# EAGLE design TestA (EAGLE 9.6.2)
IGNORE_RENUMBER: TP
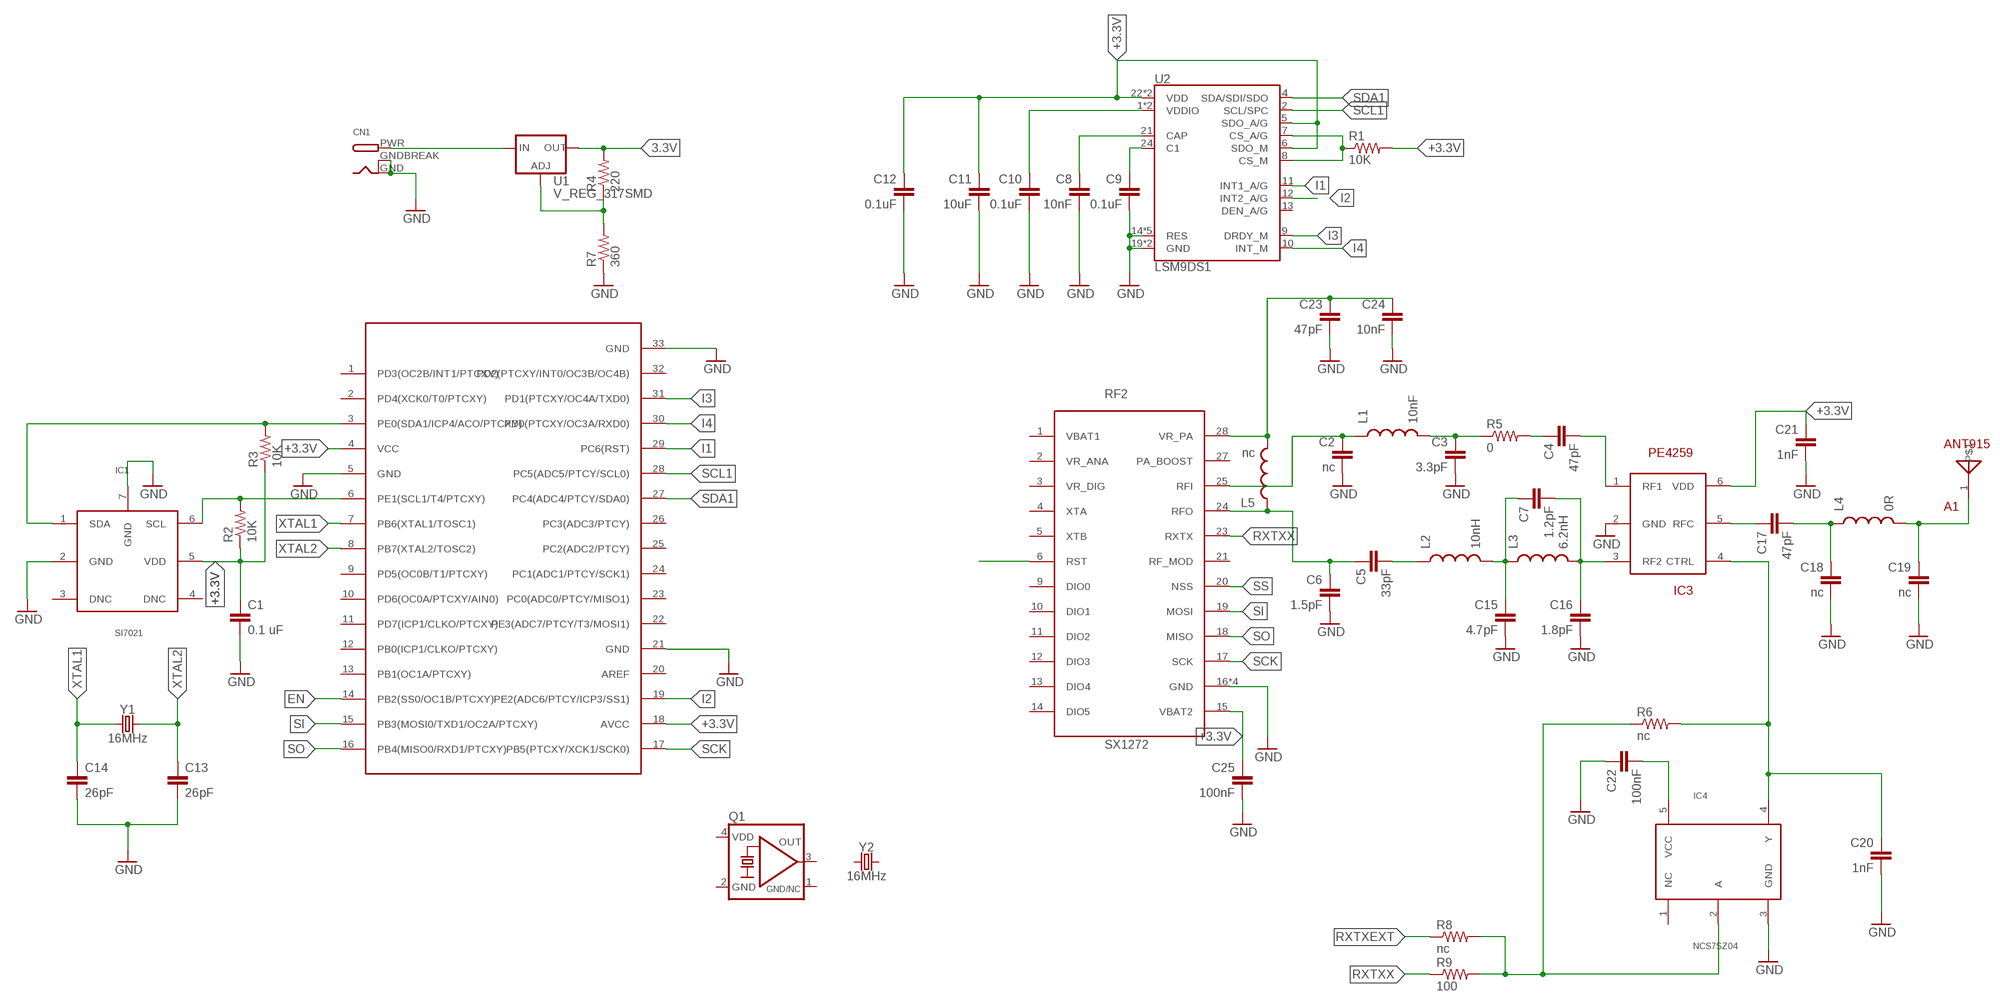
[diagram p0: schematic, sheet 1]

## Parts
A1  ANT915  [ANT915]
C1  0.1 uF  CAP0603-CAP  [0603-CAP]
C2  nc  CAP0603-CAP  [0603-CAP]
C3  3.3pF  CAP0603-CAP  [0603-CAP]
C4  47pF  CAP0603-CAP  [0603-CAP]
C5  33pF  CAP0603-CAP  [0603-CAP]
C6  1.5pF  CAP0603-CAP  [0603-CAP]
C7  1.2pF  CAP0603-CAP  [0603-CAP]
C8  10nF  CAP0603-CAP  [0603-CAP]
C9  0.1uF  CAP0603-CAP  [0603-CAP]
C10  0.1uF  CAP0603-CAP  [0603-CAP]
C11  10uF  CAP0603-CAP  [0603-CAP]
C12  0.1uF  CAP0603-CAP  [0603-CAP]
C13  26pF  CAP0603-CAP  [0603-CAP]
C14  26pF  CAP0603-CAP  [0603-CAP]
C15  4.7pF  CAP0603-CAP  [0603-CAP]
C16  1.8pF  CAP0603-CAP  [0603-CAP]
C17  47pF  CAP0603-CAP  [0603-CAP]
C18  nc  CAP0603-CAP  [0603-CAP]
C19  nc  CAP0603-CAP  [0603-CAP]
C20  1nF  CAP0603-CAP  [0603-CAP]
C21  1nF  CAP0603-CAP  [0603-CAP]
C22  100nF  CAP0603-CAP  [0603-CAP]
C23  47pF  CAP0603-CAP  [0603-CAP]
C24  10nF  CAP0603-CAP  [0603-CAP]
C25  100nF  CAP0603-CAP  [0603-CAP]
CN1  DCBARRELPTH  [DCJACK_2MM_PTH]
IC1  SI7021  [SI7021]
IC2  ATMEGA328-PB  [ATMEGA328-PB]
IC3  PE4259  [PE4259]
IC4  NCS7SZ04  [NC7SZ04]
L1  10nF  INDUCTOR0603  [0603]
L2  10nH  INDUCTOR0603  [0603]
L3  6.2nH  INDUCTOR0603  [0603]
L4  0R  INDUCTOR0603  [0603]
L5  nc  INDUCTOR0603  [0603]
Q1  KXO-TCXO-CMOS-86  [2.5X2.0_KXO-86-TCXO]
R1  10K  RESISTOR0603-RES  [0603-RES]
R2  10K  RESISTOR0603-RES  [0603-RES]
R3  10K  RESISTOR0603-RES  [0603-RES]
R4  220  RESISTOR0603-RES  [0603-RES]
R5  0  RESISTOR0603-RES  [0603-RES]
R6  nc  RESISTOR0603-RES  [0603-RES]
R7  360  RESISTOR0603-RES  [0603-RES]
R8  nc  RESISTOR0603-RES  [0603-RES]
R9  100  RESISTOR0603-RES  [0603-RES]
RF2  SX1272  [SX1272]
U1  V_REG_317SMD  [SOT223]
U2  LSM9DS1  [LGA24-8X4]
Y1  16MHz  CRYSTAL-16MHZSMD-2X1.6  [CRYSTAL-SMD-2.0X1.6MM]
Y2  16MHz  CRYSTAL-16MHZSMD-2X1.6  [CRYSTAL-SMD-2.0X1.6MM]

## Nets
3.3V: R4.2 U1.2(OUT)
+3.3V: C1.1 C11.1 C12.1 C21.1 C25.1 IC1.5(VDD) IC2.4(VCC) IC2.18(AVCC) IC3.6(VDD) R1.2 R2.1 R3.1 RF2.15(VBAT2) U2.5(SDO_A/G) U2.6(SDO_M) U2.22(VDD) U2.23(VDD)
EN: IC2.14(PB2(SS0/OC1B/PTCXY))
GND: C1.2 C2.2 C3.2 C6.2 C8.2 C9.2 C10.2 C11.2 C12.2 C13.2 C14.2 C15.2 C16.2 C18.2 C19.2 C20.2 C21.2 C22.1 C23.2 C24.2 C25.2 CN1.GND CN1.GNDBREAK IC1.2(GND) IC1.7(GND) IC2.5(GND) IC2.21(GND) IC2.33(GND) IC3.2(GND) IC4.3(GND) R7.1 RF2.16(GND) RF2.22(GND) RF2.26(GND) RF2.29(GND) U2.14(RES) U2.15(RES) U2.16(RES) U2.17(RES) U2.18(RES) U2.19(GND) U2.20(GND)
I1: IC2.29(PC6(RST)) U2.11(INT1_A/G)
I2: IC2.19(PE2(ADC6/PTCY/ICP3/SS1)) U2.12(INT2_A/G)
I3: IC2.31(PD1(PTCXY/OC4A/TXD0)) U2.9(DRDY_M)
I4: IC2.30(PD0(PTCXY/OC3A/RXD0)) U2.10(INT_M)
N$1: C4.1 R5.2
N$2: C23.1 C24.1 L5.2 RF2.28(VR_PA)
N$3: CN1.PWR U1.3(IN)
N$4: C4.2 IC3.1(RF1)
N$5: R1.1 U2.7(CS_A/G) U2.8(CS_M)
N$6: R4.1 R7.2 U1.1(ADJ)
N$7: C2.1 L1.1 RF2.25(RFI)
N$8: C8.1 U2.21(CAP)
N$9: C10.1 U2.1(VDDIO) U2.3(VDDIO)
N$10: C3.1 L1.2 R5.1
N$11: C5.1 C6.1 L5.1 RF2.24(RFO)
N$12: C7.1 C15.1 L2.2 L3.1
N$13: C5.2 L2.1
N$14: C7.2 C16.1 IC3.3(RF2) L3.2
N$15: A1.1 C19.1 L4.2
N$16: C17.1 IC3.5(RFC)
N$17: C9.1 U2.24(C1)
N$18: C17.2 C18.1 L4.1
N$19: C20.1 IC3.4(CTRL) IC4.4(Y) R6.2
N$20: C22.2 IC4.5(VCC)
N$21: IC4.2(A) R6.1 R8.2 R9.2
N$22: RF2.6(RST)
RXTXEXT: R8.1
RXTXX: R9.1 RF2.23(RXTX)
SCK: IC2.17(PB5(PTCXY/XCK1/SCK0)) RF2.17(SCK)
SCL: IC1.6(SCL) IC2.6(PE1(SCL1/T4/PTCXY)) R2.2
SCL1: IC2.28(PC5(ADC5/PTCY/SCL0)) U2.2(SCL/SPC)
SDA: IC1.1(SDA) IC2.3(PE0(SDA1/ICP4/ACO/PTCXY)) R3.2
SDA1: IC2.27(PC4(ADC4/PTCY/SDA0)) U2.4(SDA/SDI/SDO)
SI: IC2.15(PB3(MOSI0/TXD1/OC2A/PTCXY)) RF2.19(MOSI)
SO: IC2.16(PB4(MISO0/RXD1/PTCXY)) RF2.18(MISO)
SS: RF2.20(NSS)
XTAL1: C14.1 IC2.7(PB6(XTAL1/TOSC1)) Y1.1
XTAL2: C13.1 IC2.8(PB7(XTAL2/TOSC2)) Y1.3
Unconnected: IC1.3(DNC) IC1.4(DNC) IC2.1(PD3(OC2B/INT1/PTCXY)) IC2.2(PD4(XCK0/T0/PTCXY)) IC2.9(PD5(OC0B/T1/PTCXY)) IC2.10(PD6(OC0A/PTCXY/AIN0)) IC2.11(PD7(ICP1/CLKO/PTCXY)) IC2.12(PB0(ICP1/CLKO/PTCXY)) IC2.13(PB1(OC1A/PTCXY)) IC2.20(AREF) IC2.22(PE3(ADC7/PTCY/T3/MOSI1)) IC2.23(PC0(ADC0/PTCY/MISO1)) IC2.24(PC1(ADC1/PTCY/SCK1)) IC2.25(PC2(ADC2/PTCY)) IC2.26(PC3(ADC3/PTCY)) IC2.32(PD2(PTCXY/INT0/OC3B/OC4B)) IC4.1(NC) Q1.3(OUT) RF2.1(VBAT1) RF2.2(VR_ANA) RF2.3(VR_DIG) RF2.4(XTA) RF2.5(XTB) RF2.9(DIO0) RF2.10(DIO1) RF2.11(DIO2) RF2.12(DIO3) RF2.13(DIO4) RF2.14(DIO5) RF2.21(RF_MOD) RF2.27(PA_BOOST) U2.13(DEN_A/G) Y2.1 Y2.3

## Power pins joined to a net without a drawn wire
GND: Q1.2(GND)
GND/NC: Q1.1(GND/NC)
VDD: Q1.4(VDD)

## Library data of the parts
A1 = Mini-Project:ANT915
C1-C25 = SparkFun:CAP: Capacitor Standard 0603 ceramic capacitor, and 0.1" leaded capacitor.
CN1 = adafruit:DCBARREL: 2.0mm DC Barrel Jack DCJACK_2MM_PTH - Through Hole Jack (4UConnector: 05537)
IC1 = Mini-Project:SI7021
IC2 = Mini-Project:ATMEGA328-PB
IC3 = Mini-Project:PE4259
IC4 = Mini-Project:NCS7SZ04
L1-L5 = SparkFun:INDUCTOR: Inductors Basic Inductor/Choke - 0603 and 1206. Footprints are not proven and vary greatly between part numbers.
Q1 = crystal-geyer_V1_0:KXO-TCXO-CMOS: TCXO : CMOS - Serie Model Size l/w/h [mm] Frequency Range Frequency Stability Temp. Range [°C] Output AECQ 200 availabel Datasheet KXO-86 KXO-84 KXO-83 KXO-82 2.5/2.0/0.7 3.2/2.5/1.0 5.0/3.2/1.5 7.0/5.0/2.4 13,0 ~ 40,0 MHz 10,0 ~ 40,0 MHz 10,0 ~ 40,0 MHz 10,0 ~ 30,0 MHz ±1,0 … ±2,5ppm ±1,0 … ±2,5ppm ±1,0 … ±3,0ppm ±1,0 … ±3,0ppm (*) -30°C …+75°C (*) -40°C …+85°C (*) -40°C …+85°C (*) -30°C …+80°C CMOS CMOS CMOS CMOS - - - - KXO-86.pdf <http://www.geyer-electronic.de/uploads/tx_userartikelfrequenz/GEYER-KXO-86-TCXO-HCMOS.pdf> KXO-84.pdf <http://www.geyer-electronic.de/uploads/tx_userartikelfrequenz/GEYER-KXO-84-TCXO-HCMOS.pdf> KXO-83.pdf <http://www.geyer-electronic.de/uploads/tx_userartikelfrequenz/GEYER-KXO-83-TCXO-HCMOS.pdf> KXO-82.pdf <http://www.geyer-electronic.de/uploads/tx_userartikelfrequenz/GEYER-KXO-82-TCXO-HCMOS.pdf> <http://www.geyer-electronic.de/fileadmin/template/img/logo-geyer-electronic.png> Details see: http://www.geyer-electronic.de/Frequenz-Produkte.9.0.html Created 2016-06-07, Hans Locher 2016 (C) Geyer Quartz Technology KXO86,KXO84,KXO83,KXO82;2550;3225;5032;7050;2,5x2,0;3,2x2,5;2.5x2.0;3.2x2.5,5,0x3,2;7,0x5,0,5.0x3.2,7.0x5.0
R1-R9 = SparkFun:RESISTOR: Resistor Basic schematic elements and footprints for 0603, 1206, and PTH resistors.
RF2 = Mini-Project:SX1272
U1 = SparkFun:V_REG_317: Voltage Regulator Standard LM317 adjustable voltage regulator. AOI (Adjust Output Input). Google 'LM317 Calculator' for easy to use app to get the two resistor values needed. 240/720 for 5V output. 240/390 for 3.3V output. Spark Fun Electronics SKU : COM-00527
U2 = LSM9DS1:LSM9DS1: LSM9DS1 3D accelerometer, gyroscope & magnetometer The LSM9DS1 is a system-in-package featuring a 3D digital linear acceleration sensor, a 3D digital angular rate sensor, and a 3D digital magnetic sensor. The LSM9DS1 has a linear acceleration full scale of ±2g/±4g/±8/±16 g, a magnetic field full scale of ±4/±8/±12/±16 gauss and an angular rate of ±245/±500/±2000 dps. The LSM9DS1 includes an I2 C serial bus interface supporting standard and fast mode (100 kHz and 400 kHz) and an SPI serial standard interface. Magnetic, accelerometer and gyroscope sensing can be enabled or set in power-down mode separately for smart power management. The LSM9DS1 is available in a plastic land grid array package (LGA) and it is guaranteed to operate over an extended temperature range from -40 °C to +85 °C.; PROD_ID: IC-12536
Y1 Y2 = SparkFun-Clocks:CRYSTAL-16MHZ: 16MHz Crystal Digikey Example <http://www.digikey.com/product-search/en?keywords=535-9122-1-ND> Frequency: 16MHz Frequency Stability: ±50ppm Frequency Tolerance: ±20ppm Load Capacitance: 18pF SparkFun Products: Pro Micro -5V/16MHz <https://www.sparkfun.com/products/12640> SparkFun Serial Enabled LCD Kit <https://www.sparkfun.com/products/10097>; PROD_ID: XTAL-14681

## Board
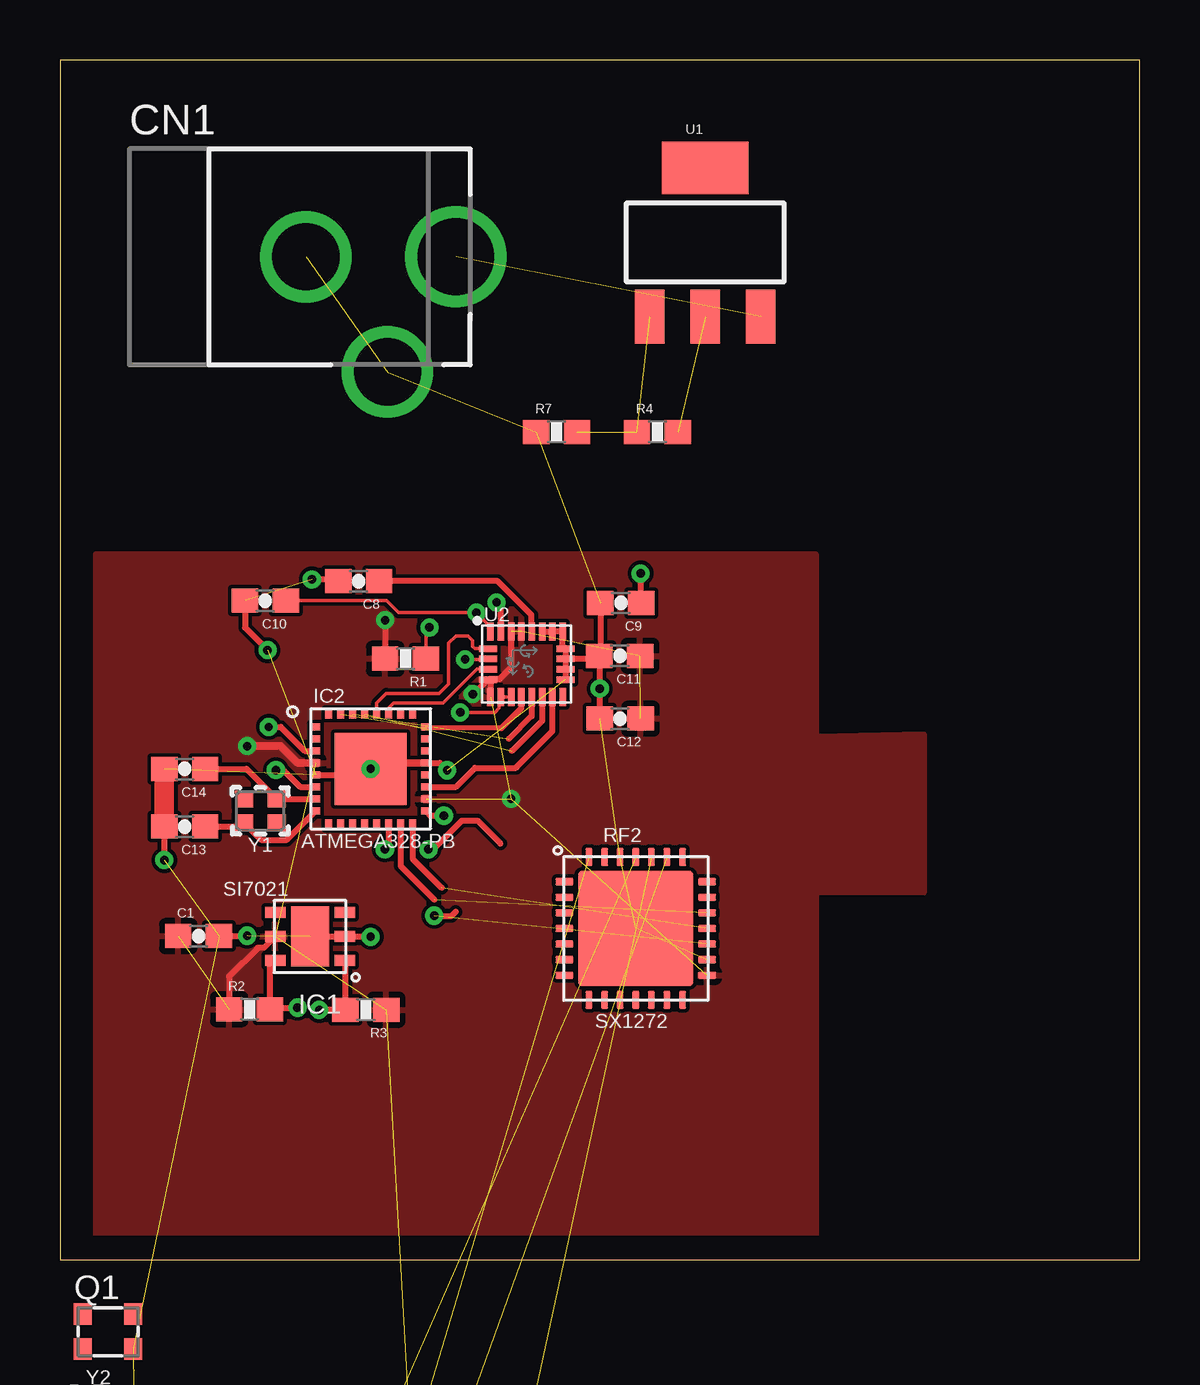
[diagram p1: board, top side]
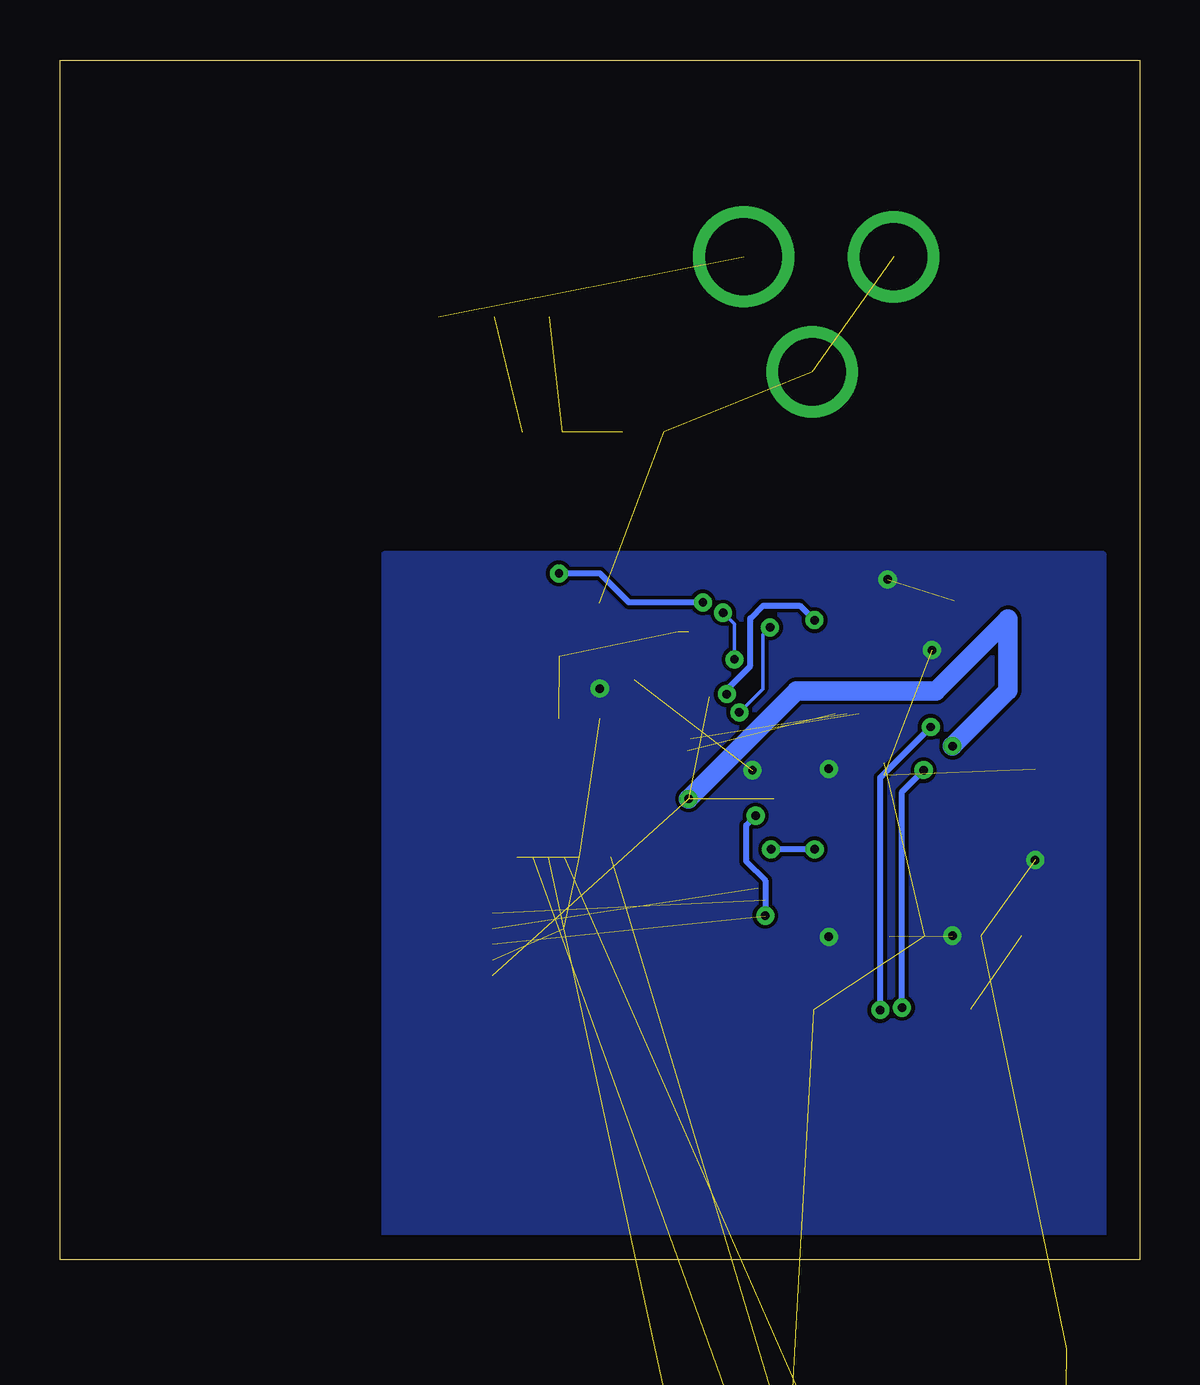
[diagram p2: board, bottom side, seen from below]

Size 45 x 50 mm. Coordinates in mm from the lower left corner, seen from the top.
Outline: 0,0 45,0 45,50 0,50 0,0
Copper layers (1*16): Top 0.035mm / dielectric 1.5mm / Bottom 0.035mm
Design rules "default": minimum track width 6mil, minimum drill 0.35mm, track to track 6mil, track to pad 6mil, pad to pad 6mil, via to via 6mil, smd to smd 6mil, copper to edge 40mil, drill to drill 6mil, minimum pad ring 10mil, minimum via ring 8mil, stop-mask expansion 4mil, vias tented up to drill 0mil, thermal gap 10mil

### Footprints (pad centres in the part's own frame; a part is rotated, then mirrored left to right if it is on the bottom)
ANT915 = smd 2 x 2.5: 1 -5.1,0; 2 5.1,0
0603-CAP = smd 1.1 x 1: 1 -0.85,0; 2 0.85,0
DCJACK_2MM_PTH = drill 2.8: GND 0,7.35; GNDBREAK 4.8,10.75 | drill 3.2: PWR 0,13.6
SI7021 = smd 0.85 x 0.45: 1 -1.45,1; 2 -1.45,0; 3 -1.45,-1; 4 1.45,-1; 5 1.45,0; 6 1.45,1 | smd 1.6 x 2.5: 7 0,0
ATMEGA328-PB = smd 0.4 x 0.3: 1 -2.3,1.75; 2 -2.3,1.25; 3 -2.3,0.75; 4 -2.3,0.25; 5 -2.3,-0.25; 6 -2.3,-0.75; 7 -2.3,-1.25; 8 -2.3,-1.75; 17 2.3,-1.75; 18 2.3,-1.25; 19 2.3,-0.75; 20 2.3,-0.25; 21 2.3,0.25; 22 2.3,0.75; 23 2.3,1.25; 24 2.3,1.75 | smd 0.3 x 0.4: 9 -1.75,-2.3; 10 -1.25,-2.3; 11 -0.75,-2.3; 12 -0.25,-2.3; 13 0.25,-2.3; 14 0.75,-2.3; 15 1.25,-2.3; 16 1.75,-2.3; 25 1.75,2.3; 26 1.25,2.3; 27 0.75,2.3; 28 0.25,2.3; 29 -0.25,2.3; 30 -0.75,2.3; 31 -1.25,2.3; 32 -1.75,2.3 | smd 3 x 3: 33 0,0
PE4259 = smd 0.4 x 0.9: 1 -0.65,-1.05; 2 0,-1.05; 3 0.65,-1.05; 4 0.65,1.05; 5 0,1.05; 6 -0.65,1.05
NC7SZ04 = smd 0.7 x 1: 1 -0.95,-1.2; 2 0,-1.2; 3 0.95,-1.2; 4 0.95,1.2; 5 -0.95,1.2
0603 = smd 1.1 x 1: 1 -0.85,0; 2 0.85,0
2.5X2.0_KXO-86-TCXO = smd 0.75 x 0.9: 1 -1.05,-0.725; 2 1.05,-0.725; 3 1.05,0.725; 4 -1.05,0.725
0603-RES = smd 1.1 x 1: 1 -0.85,0; 2 0.85,0
SX1272 = smd 0.75 x 0.3: 1 -2.975,1.95; 2 -2.975,1.3; 3 -2.975,0.65; 4 -2.975,0; 5 -2.975,-0.65; 6 -2.975,-1.3; 7 -2.975,-1.95; 15 2.975,-1.95; 16 2.975,-1.3; 17 2.975,-0.65; 18 2.975,0; 19 2.975,0.65; 20 2.975,1.3; 21 2.975,1.95 | smd 0.3 x 0.75: 8 -1.95,-2.975; 9 -1.3,-2.975; 10 -0.65,-2.975; 11 0,-2.975; 12 0.65,-2.975; 13 1.3,-2.975; 14 1.95,-2.975; 22 1.95,2.975; 23 1.3,2.975; 24 0.65,2.975; 25 0,2.975; 26 -0.65,2.975; 27 -1.3,2.975; 28 -1.95,2.975 | smd 4.8 x 4.8: 29 0,0
SOT223 = smd 1.219 x 2.235: 1 -2.311,-3.099; 2 0,-3.099; 3 2.311,-3.099 | smd 3.6 x 2.2: 4 0,3.099
LGA24-8X4 = smd 0.27 x 0.75: 1 -1.505,1.365; 6 -1.505,-1.365; 7 -1.075,-1.365; 8 -0.645,-1.365; 9 -0.215,-1.365; 10 0.215,-1.365; 11 0.645,-1.365; 12 1.075,-1.365; 13 1.505,-1.365; 18 1.505,1.365; 19 1.075,1.365; 20 0.645,1.365; 21 0.215,1.365; 22 -0.215,1.365; 23 -0.645,1.365; 24 -1.075,1.365 | smd 0.75 x 0.27: 2 -1.615,0.645; 3 -1.615,0.215; 4 -1.615,-0.215; 5 -1.615,-0.645; 14 1.615,-0.645; 15 1.615,-0.215; 16 1.615,0.215; 17 1.615,0.645
CRYSTAL-SMD-2.0X1.6MM = smd 0.75 x 0.7: 1 -0.675,-0.5; 2 0.675,-0.5; 3 0.675,0.5; 4 -0.675,0.5

### Placement (x,y rotation side)
A1  6.7,-30.5 0 top  (outside the outline)
C1  5.78,13.48 0 top
C2  1.6,-36.2 0 top  (outside the outline)
C3  4.7,-36.2 0 top  (outside the outline)
C4  7.8,-36.2 0 top  (outside the outline)
C5  10.9,-36.2 0 top  (outside the outline)
C6  14,-36.2 0 top  (outside the outline)
C7  17.1,-36.2 0 top  (outside the outline)
C8  12.45,28.28 180 top
C9  23.38,27.37 180 top
C10  8.56,27.46 180 top
C11  23.34,25.16 180 top
C12  23.35,22.55 180 top
C13  5.2,18.05 180 top
C14  5.2,20.45 180 top
C15  1.6,-39.2 0 top  (outside the outline)
C16  4.7,-39.2 0 top  (outside the outline)
C17  7.8,-39.2 0 top  (outside the outline)
C18  10.9,-39.2 0 top  (outside the outline)
C19  14,-39.2 0 top  (outside the outline)
C20  1.6,-15.5 0 top  (outside the outline)
C21  17.1,-39.2 0 top  (outside the outline)
C22  4.7,-15.5 0 top  (outside the outline)
C23  1.6,-54.2 0 top  (outside the outline)
C24  1.6,-57.2 0 top  (outside the outline)
C25  1.6,-63.2 0 top  (outside the outline)
CN1  2.9,41.8 270 top
IC1  10.43,13.46 180 top
IC2  12.95,20.45 0 top
IC3  15.9,-20.3 0 top  (outside the outline)
IC4  2.2,-11.1 0 top  (outside the outline)
L1  1.6,-42.2 0 top  (outside the outline)
L2  4.7,-42.2 0 top  (outside the outline)
L3  7.8,-42.2 0 top  (outside the outline)
L4  10.9,-42.2 0 top  (outside the outline)
L5  1.6,-60.2 0 top  (outside the outline)
Q1  2,-3 0 top
R1  14.4,25.05 180 top
R2  7.9,10.43 0 top
R3  12.75,10.41 180 top
R4  24.9,34.5 0 top
R5  14,-42.2 0 top  (outside the outline)
R6  1.6,-45.2 0 top  (outside the outline)
R7  20.7,34.5 0 top
R8  1.6,-48.2 0 top  (outside the outline)
R9  1.6,-51.2 0 top  (outside the outline)
RF2  24,13.8 0 top
U1  26.9,42.4 0 top
U2  19.45,24.82 0 top
Y1  8.35,18.7 180 top
Y2  1.6,-6.3 0 top  (outside the outline)

### Tracks (layer width: path | path; a pad name or v marks a point on that pad's centre or on a via)
3.3V  (1 unrouted)
+3.3V  (via drill 0.35)  (12 unrouted)
  Top 0.254: IC1.5 8.51,13 8.25,13 7.05,11.8 R2.1 | U2.5 17.84,24.15 17.88,24.19 18.33,24.19 18.8,24.67 U2.23 | U2.5 17.95,24.07 U2.6 | U2.5 17.23,23.57 v17.2,23.57 | v13.55,26.65 R1.2
  Top 0.305: v7.8,21.4 9.2,21.4 9.9,20.7 IC2.4
  Bottom 0.254: v17.2,23.57 17.2,23.77 16.23,24.74 16.23,26.72 15.69,27.26 14.16,27.26 v13.55,26.65
  Bottom 0.813: v7.8,21.4 5.48,23.72 5.48,26.7 8.48,23.7 14.3,23.7 v18.8,19.2
  pour Top: 1.5,29.4 31.5,29.4 31.5,21.8 36,21.9 36,21.8 36,15.3 31.5,15.3 31.5,0 1.5,0
EN  (via drill 0.35 pad 0.55)
  Top 0.254: IC2.14 13.7,17.26 v13.54,17.1 | v15.36,17.1 15.56,17.1 16.76,18.3 17.4,18.3 18.36,17.34
  Bottom 0.254: v13.54,17.1 v15.36,17.1
GND  (via drill 0.35, 0.35 pad 0.55)  (29 unrouted)
  Top 0.152: 22.48,23.82 v22.5,23.8
  Top 0.254: U2.14 U2.15 U2.16 | C12.2 v22.5,23.8 | C11.2 22.48,23.82 | U2.16 U2.17 20.95,25.57 U2.18 U2.19 U2.20 | C11.2 22.36,25.04 U2.16 | C9.2 22.52,25.2 C11.2 | C8.2 11.53,28.35 v10.5,28.35 | v8.65,25.4 7.71,26.34 C10.2 | IC2.21 15.83,20.7 v16.14,20.39 | v12.95,13.45 12.94,13.46 IC1.2 IC1.7 | C1.2 7.78,13.48 v7.8,13.5 | C13.2 v4.35,16.65 | IC2.5 12.7,20.2 IC2.33
  Top 0.305: IC2.21 13.2,20.7 IC2.33
  Top 0.813: C14.2 C13.2
  other vias: 12.95,20.45
  pour Bottom: 1.5,29.4 31.5,29.4 31.5,0 1.5,0
I1  (1 unrouted)
  Top 0.254: U2.11 20.09,22.45 18.84,21.2
I2
  Top 0.254: IC2.19 16.5,19.7 17.3,20.5 19,20.5 19.1,20.6 20.52,22.02 U2.12
I3  (1 unrouted)
  Top 0.203: 18.41,22.15 15.3,22.15
  Top 0.254: 18.41,22.15 19.23,22.98 U2.9
I4  (1 unrouted)
  Top 0.254: U2.10 19.66,22.65 18.71,21.7
N$1  (1 unrouted)
N$2  (3 unrouted)
N$3  (1 unrouted)
N$4  (1 unrouted)
N$5  (via drill 0.35 pad 0.55)
  Top 0.152: U2.8 U2.7 18.31,23.39 18.31,22.98 18.13,22.81 v16.68,22.81 | v15.4,26.35 15.25,26.2 R1.1
  Bottom 0.152: v16.68,22.81 15.7,23.79 15.7,26.05 v15.4,26.35
N$6  (2 unrouted)
N$7  (2 unrouted)
N$8
  Top 0.254: U2.21 19.65,26.2 19.65,26.87 18.24,28.28 C8.1
N$9  (via drill 0.35 pad 0.55)
  Top 0.152: C10.1 13.61,27.46 14.11,26.96 v17.36,26.96 17.95,26.38 U2.1 | U2.3 17.82,25.02 v16.89,25.02
  Bottom 0.152: v16.89,25.02 16.89,26.48 v17.36,26.96
N$10  (2 unrouted)
N$11  (3 unrouted)
N$12  (3 unrouted)
N$13  (1 unrouted)
N$14  (3 unrouted)
N$15  (2 unrouted)
N$16  (1 unrouted)
N$17  (via drill 0.35)
  Top 0.254: U2.24 18.38,27.22 v18.2,27.39 | v24.2,28.6 24.2,27.39 C9.1
  Bottom 0.254: v18.2,27.39 21.29,27.39 22.5,28.6 v24.2,28.6
N$18  (2 unrouted)
N$19  (3 unrouted)
N$20  (1 unrouted)
N$21  (3 unrouted)
RXTXX  (1 unrouted)
SCK  (via drill 0.35 pad 0.55)  (1 unrouted)
  Top 0.254: IC2.17 15.45,18.5 v16,18.5 | v15.6,14.33 16.33,14.33 16.49,14.49
  Bottom 0.254: v16,18.5 16.4,18.1 16.4,16.6 15.6,15.8 v15.6,14.33
SCL  (via drill 0.35)
  Top 0.254: IC1.6 8.75,12.24 R2.2 8.82,10.5 v9.9,10.5 | v9,20.4 9.3,20.4 10,19.7 IC2.6
  Bottom 0.254: v9.9,10.5 9.9,19.5 v9,20.4
SCL1
  Top 0.152: IC2.28 13.2,23.2 13.6,23.6 15.8,23.6 16.2,24 16.2,25.7 16.5,26 17,26 17.2,25.8 17.2,25.56 17.29,25.46 U2.2
SDA  (via drill 0.35)
  Top 0.2: 11.88,12.43 IC1.1
  Top 0.254: 11.88,12.43 11.9,12.4 R3.2 10.82,10.41 v10.81,10.4 | v8.7,22.2 9.2,22.2 10.2,21.2 IC2.3
  Bottom 0.254: v10.81,10.4 10.81,20.09 v8.7,22.2
SDA1
  Top 0.152: IC2.27 13.7,23 13.9,23.2 15.98,23.2 17.38,24.61 U2.4
SI  (1 unrouted)
  Top 0.254: IC2.15 14.2,16.4 15.61,14.99
SO  (1 unrouted)
  Top 0.254: IC2.16 14.7,16.7 15.91,15.49
XTAL1
  Top 0.254: IC2.7 Y1.1 7.78,20.45 C14.1
XTAL2
  Top 0.254: Y1.3 7.69,18.19 | 7.69,18.19 8.38,17.5 9.45,17.5 IC2.8 | C13.1 7.55,18.05 7.69,18.19